# Altium project PIFRobot.PrjPCB
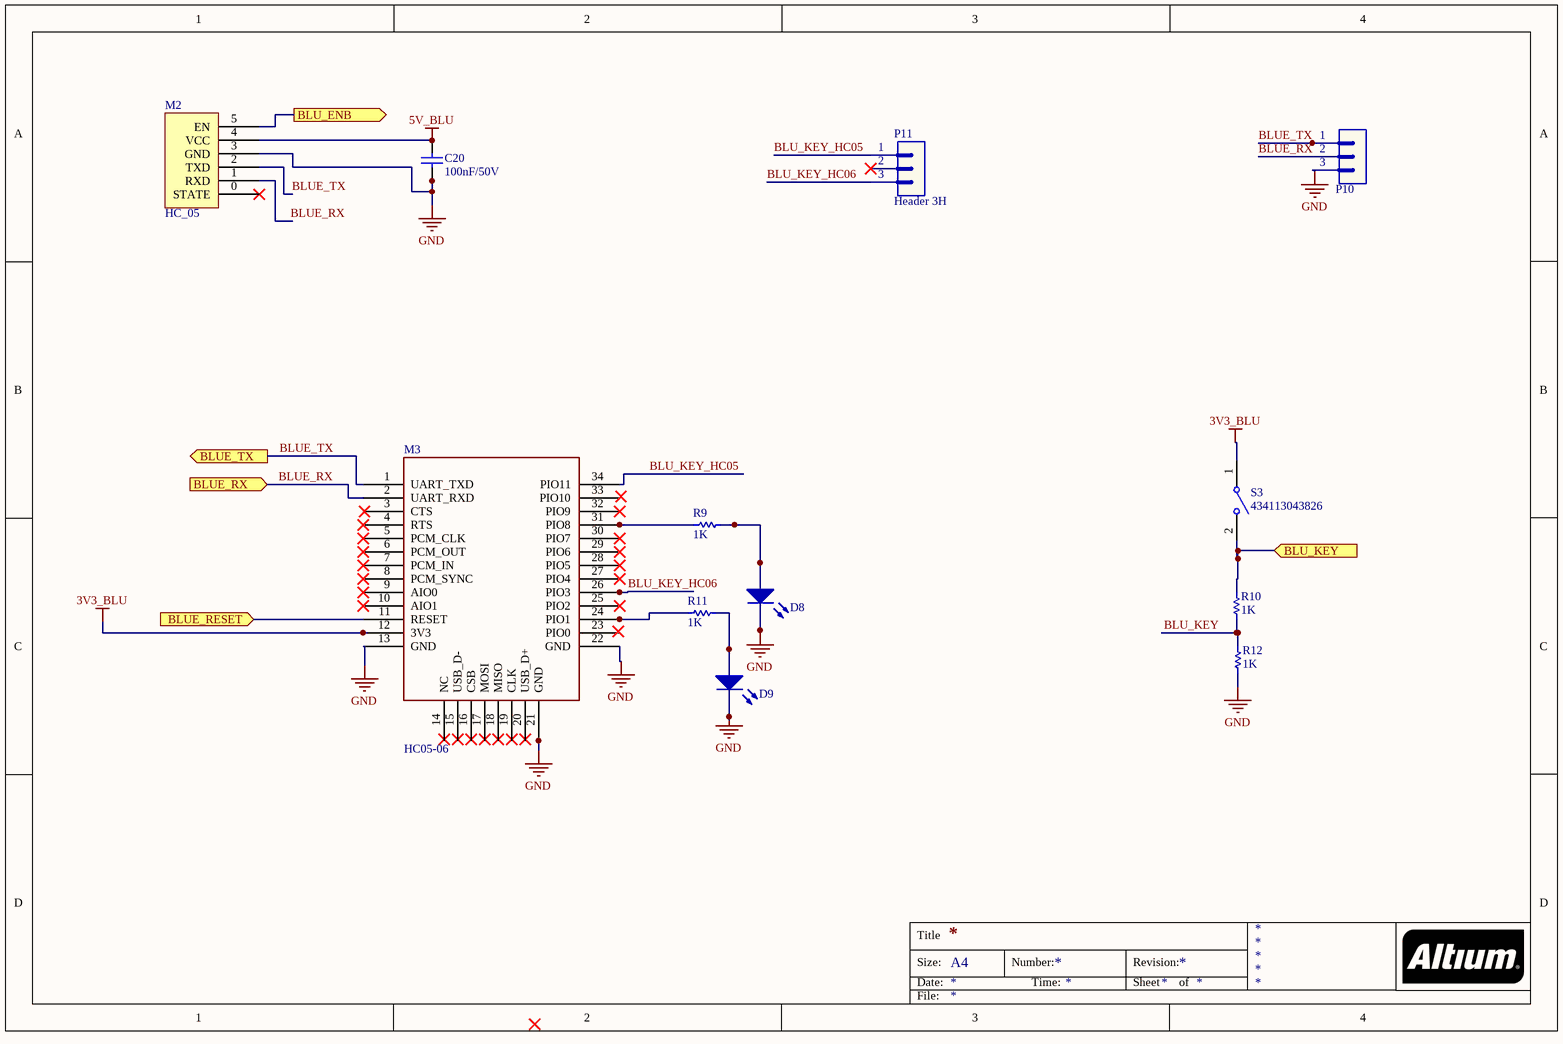
[diagram p0: Bluetooth.schdoc]
6 sheets, 118 parts. Net scope: flat (ports and power ports of the same name join across sheets).
Board file: PCB1.PcbDoc
Sheets:
  Bluetooth.schdoc
  DWM.SchDoc
  MCU.schdoc
  Motor.schdoc
  Power.SchDoc
  RF.schdoc

## Sheet Bluetooth.schdoc
size A4

### Parts
C20  value 100nF/50V  [CAP-SM-0805]  (hidden comment: Cap-100nF-50V-0805)
D8  LED  [LED_0805_Blue]  (value not drawn)
D9  LED  [LED_0805_Blue]  (value not drawn)
M2  HC_05  [PCBComponent_1]
M3  HC05-06
P10  Header 3  [JP3]  (value not drawn)
P11  Header 3H  [JP3H]
R9  value 1K  [RES-SM-0805]  (hidden comment: Resistor 1/4W)
R10  value 1K  [RES-SM-1206]  (hidden comment: Resistor 1/4W)
R11  value 1K  [RES-SM-0805]  (hidden comment: Resistor 1/4W)
R12  value 1K  [RES-SM-0805]  (hidden comment: Resistor 1/4W)
S3  434113043826  [434113043826]

### Ports
BLU_ENB (out), BLU_KEY (in), BLUE_RESET (in), BLUE_RX (in), BLUE_TX (out)

### Nets
3V3_BLU: M3.12(3V3) S3.1
5V_BLU: C20.2 M2.4(VCC)  [project net 5V]
GND: C20.1 D8.2(K) D9.2(K) M2.3(GND) M3.13(GND) M3.21(GND) M3.22(GND) P10.3 R12.1
BLU_KEY: R10.1 R12.2
BLU_KEY_HC05: M3.34(PIO11) P11.1
BLU_KEY_HC06: M3.26(PIO3) P11.3
BLUE_RX: M2.1(RXD) M3.2(UART_RXD) P10.2 ; port BLUE_RX
BLUE_TX: M2.2(TXD) M3.1(UART_TXD) P10.1 ; port BLUE_TX
NetD8_1: D8.1(A) R9.1
NetD9_1: D9.1(A) R11.1
NetM2_5: M2.5(EN) ; port BLU_ENB
NetM3_11: M3.11(RESET) ; port BLUE_RESET
NetM3_24: M3.24(PIO1) R11.2
NetM3_31: M3.31(PIO8) R9.2
NetR10_2: R10.2 S3.2 ; port BLU_KEY

Not connected (* = marked no-connect by the designer): M2 0(STATE)*; M3 3(CTS) 4(RTS)* 5(PCM_CLK)* 6(PCM_OUT)* 7(PCM_IN)* 8(PCM_SYNC)* 9(AIO0)* 10(AIO1)* 14(NC) 15(USB_D-) 16(CSB) 17(MOSI) 18(MISO) 19(CLK) 20(USB_D+) 23(PIO0) 25(PIO2)* 27(PIO4)* 28(PIO5)* 29(PIO6)* 30(PIO7)* 32(PIO9)* 33(PIO10); P11 2*

### Notes on the sheet
- Title
- Size:
- Date:
- A4
- Number:
- Time:
- Revision:
- Sheet
- of
- File:

### Library data of the parts
C20 = Cap-100nF-50V-0805: CAP CER 0.1UF 50V Y5V 0805; Manufacturer: Samsung Electro-Mechanics; Manufacturer Part Number: CL21F104ZBCNNNC; Local Supplier: thegioiic; Local Supplier Link: https://thegioiic.com/products/tu-100nf-0-1uf-50v-0805; Supplier 1: Digikey; Supplier 1 Part Number: 1276-1007-1-ND; Supplier 1 Link: https://www.digikey.com/product-detail/en/samsung-electro-mechanics/CL21F104ZBCNNNC/1276-1007-1-ND/3889093
P10 = Header 3: Header, 3-Pin; LatestRevisionDate: 17-Jul-2002; LatestRevisionNote: Re-released for DXP Platform.; Publisher: Altium Limited
P11 = Header 3H: Header, 3-Pin, Right Angle; LatestRevisionDate: 17-Jul-2002; LatestRevisionNote: Re-released for DXP Platform.; Publisher: Altium Limited
R9-R12 = RES
S3 = 434113043826: WS-TASV J-Bend SMT Tact Switch 6x3.5mm, height 4.3mm, 260gf; Rated Voltage: 12VDC; Rated Current: 50mA; Washable: No; ComponentLink1Description: Manufacturer; ComponentLink1URL: http://www.we-online.de; ComponentLink2Description: Datasheet; ComponentLink2URL: https://katalog.we-online.com/em/datasheet/434113043826.pdf; Operating Temperature: -40 to +85degC; Part Number: 434113043826; Published Date: September 2019; Contact Material: Stainless Steel; Height: 4.3mm; Mounting Technology: SMT; Contact Plating: Silver; Operation Force: 260gf; Packaging: Tape and Reel; Terminal Material: Copper Alloy; Publisher: Wurth Elektronik; Terminal Plating: Silver

## Sheet DWM.SchDoc
size A
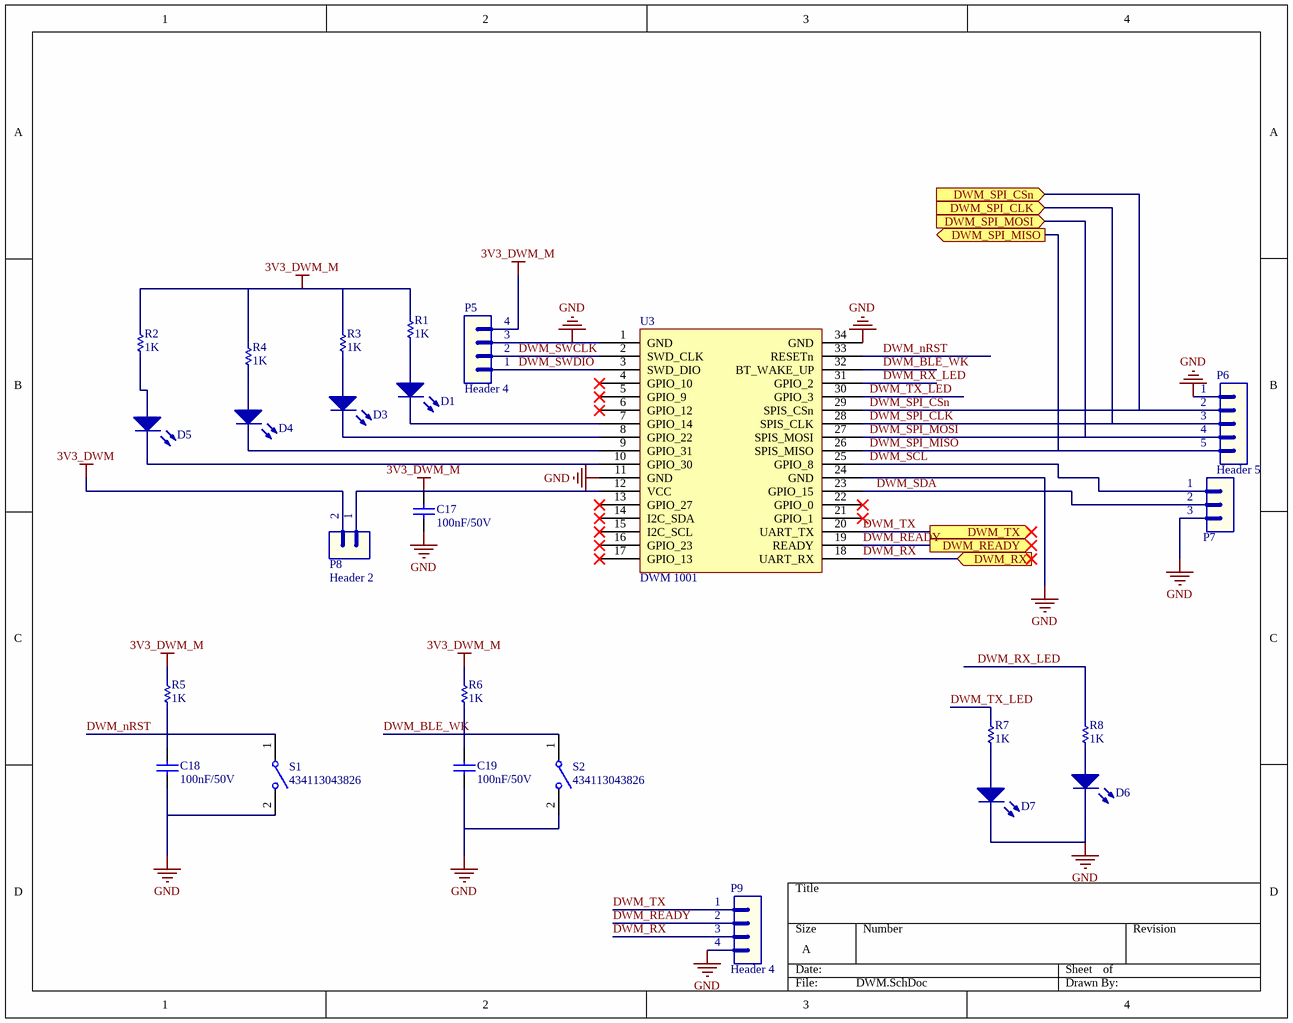
[diagram p1: DWM.SchDoc]

### Parts
C17  value 100nF/50V  [CAP-SM-0805]  (hidden comment: Cap-100nF-50V-0805)
C18  value 100nF/50V  [CAP-SM-0805]  (hidden comment: Cap-100nF-50V-0805)
C19  value 100nF/50V  [CAP-SM-0805]  (hidden comment: Cap-100nF-50V-0805)
D1  LED  [LED_0805_Blue]  (value not drawn)
D3  LED  [LED_0805_Blue]  (value not drawn)
D4  LED  [LED_0805_Blue]  (value not drawn)
D5  LED  [LED_0805_Blue]  (value not drawn)
D6  LED  [LED_0805_Blue]  (value not drawn)
D7  LED  [LED_0805_Blue]  (value not drawn)
P5  Header 4  [JP4]
P6  Header 5  [JP5]
P7  Header 3  [JP3]  (value not drawn)
P8  Header 2  [JP2]
P9  Header 4  [JP4]
R1  value 1K  [RES-SM-0805]  (hidden comment: Resistor 1/4W)
R2  value 1K  [RES-SM-0805]  (hidden comment: Resistor 1/4W)
R3  value 1K  [RES-SM-0805]  (hidden comment: Resistor 1/4W)
R4  value 1K  [RES-SM-0805]  (hidden comment: Resistor 1/4W)
R5  value 1K  [RES-SM-0805]  (hidden comment: Resistor 1/4W)
R6  value 1K  [RES-SM-0805]  (hidden comment: Resistor 1/4W)
R7  value 1K  [RES-SM-0805]  (hidden comment: Resistor 1/4W)
R8  value 1K  [RES-SM-0805]  (hidden comment: Resistor 1/4W)
S1  434113043826  [434113043826]
S2  434113043826  [434113043826]
U3  DWM 1001  [PCBComponent_1]

### Ports
DWM_READY (out), DWM_RX (in), DWM_SPI_CLK (in), DWM_SPI_CSn (in), DWM_SPI_MISO (out), DWM_SPI_MOSI (in), DWM_TX (out)

### Nets
3V3_DWM: P8.2
3V3_DWM_M: C17.2 P5.4 P8.1 R1.2 R2.2 R3.2 R4.2 R5.2 R6.2 U3.12(VCC)
GND: C17.1 C18.1 C19.1 D6.2(K) D7.2(K) P5.3 P6.1 P7.3 P9.4 S1.2 S2.2 U3.1(GND) U3.11(GND) U3.24(GND) U3.34(GND)
DWM_BLE_WK: C19.2 R6.1 S2.1 U3.32(BT_WAKE_UP)
DWM_nRST: C18.2 R5.1 S1.1 U3.33(RESETn)
DWM_READY: P9.2 U3.19(READY) ; port DWM_READY
DWM_RX: P9.3 U3.18(UART_RX) ; port DWM_RX
DWM_RX_LED: R8.2 U3.31(GPIO_2)
DWM_SCL: P7.1 U3.25(GPIO_8)
DWM_SDA: P7.2 U3.23(GPIO_15)
DWM_SPI_CLK: P6.3 U3.28(SPIS_CLK) ; port DWM_SPI_CLK
DWM_SPI_CSn: P6.2 U3.29(SPIS_CSn) ; port DWM_SPI_CSn
DWM_SPI_MISO: P6.5 U3.26(SPIS_MISO) ; port DWM_SPI_MISO
DWM_SPI_MOSI: P6.4 U3.27(SPIS_MOSI) ; port DWM_SPI_MOSI
DWM_SWCLK: P5.2 U3.2(SWD_CLK)
DWM_SWDIO: P5.1 U3.3(SWD_DIO)
DWM_TX: P9.1 U3.20(UART_TX) ; port DWM_TX
DWM_TX_LED: R7.2 U3.30(GPIO_3)
NetD1_1: D1.1(A) R1.1
NetD1_2: D1.2(K) U3.7(GPIO_14)
NetD3_1: D3.1(A) R3.1
NetD3_2: D3.2(K) U3.8(GPIO_22)
NetD4_1: D4.1(A) R4.1
NetD4_2: D4.2(K) U3.9(GPIO_31)
NetD5_1: D5.1(A) R2.1
NetD5_2: D5.2(K) U3.10(GPIO_30)
NetD6_1: D6.1(A) R8.1
NetD7_1: D7.1(A) R7.1

Not connected (* = marked no-connect by the designer): U3 4(GPIO_10)* 5(GPIO_9)* 6(GPIO_12)* 13(GPIO_27)* 14(I2C_SDA)* 15(I2C_SCL)* 16(GPIO_23)* 17(GPIO_13)* 21(GPIO_1)* 22(GPIO_0)*

### Library data of the parts
C17-C19 = Cap-100nF-50V-0805: as C20 on sheet Bluetooth; Local Supplier: thegioiic; Local Supplier Link: https://thegioiic.com/products/tu-100nf-0-1uf-50v-0805; Supplier 1: Digikey; Supplier 1 Part Number: 1276-1007-1-ND; Supplier 1 Link: https://www.digikey.com/product-detail/en/samsung-electro-mechanics/CL21F104ZBCNNNC/1276-1007-1-ND/3889093
P5 P9 = Header 4: Header, 4-Pin; LatestRevisionDate: 17-Jul-2002; LatestRevisionNote: Re-released for DXP Platform.; Publisher: Altium Limited
P6 = Header 5: Header, 5-Pin; LatestRevisionDate: 17-Jul-2002; LatestRevisionNote: Re-released for DXP Platform.; Publisher: Altium Limited
P7 = Header 3: Header, 3-Pin; LatestRevisionDate: 17-Jul-2002; LatestRevisionNote: Re-released for DXP Platform.; Publisher: Altium Limited
P8 = Header 2: Header, 2-Pin; LatestRevisionDate: 17-Jul-2002; LatestRevisionNote: Re-released for DXP Platform.; Publisher: Altium Limited
R1-R8 = RES
S1 S2 = 434113043826: as S3 on sheet Bluetooth; ComponentLink1Description: Manufacturer; ComponentLink1URL: http://www.we-online.de; ComponentLink2Description: Datasheet; ComponentLink2URL: https://katalog.we-online.com/em/datasheet/434113043826.pdf; Operating Temperature: -40 to +85degC; Part Number: 434113043826; Published Date: September 2019; Contact Material: Stainless Steel; Height: 4.3mm; Mounting Technology: SMT; Contact Plating: Silver; Operation Force: 260gf; Packaging: Tape and Reel; Terminal Material: Copper Alloy; Publisher: Wurth Elektronik; Terminal Plating: Silver

## Sheet MCU.schdoc
size A4
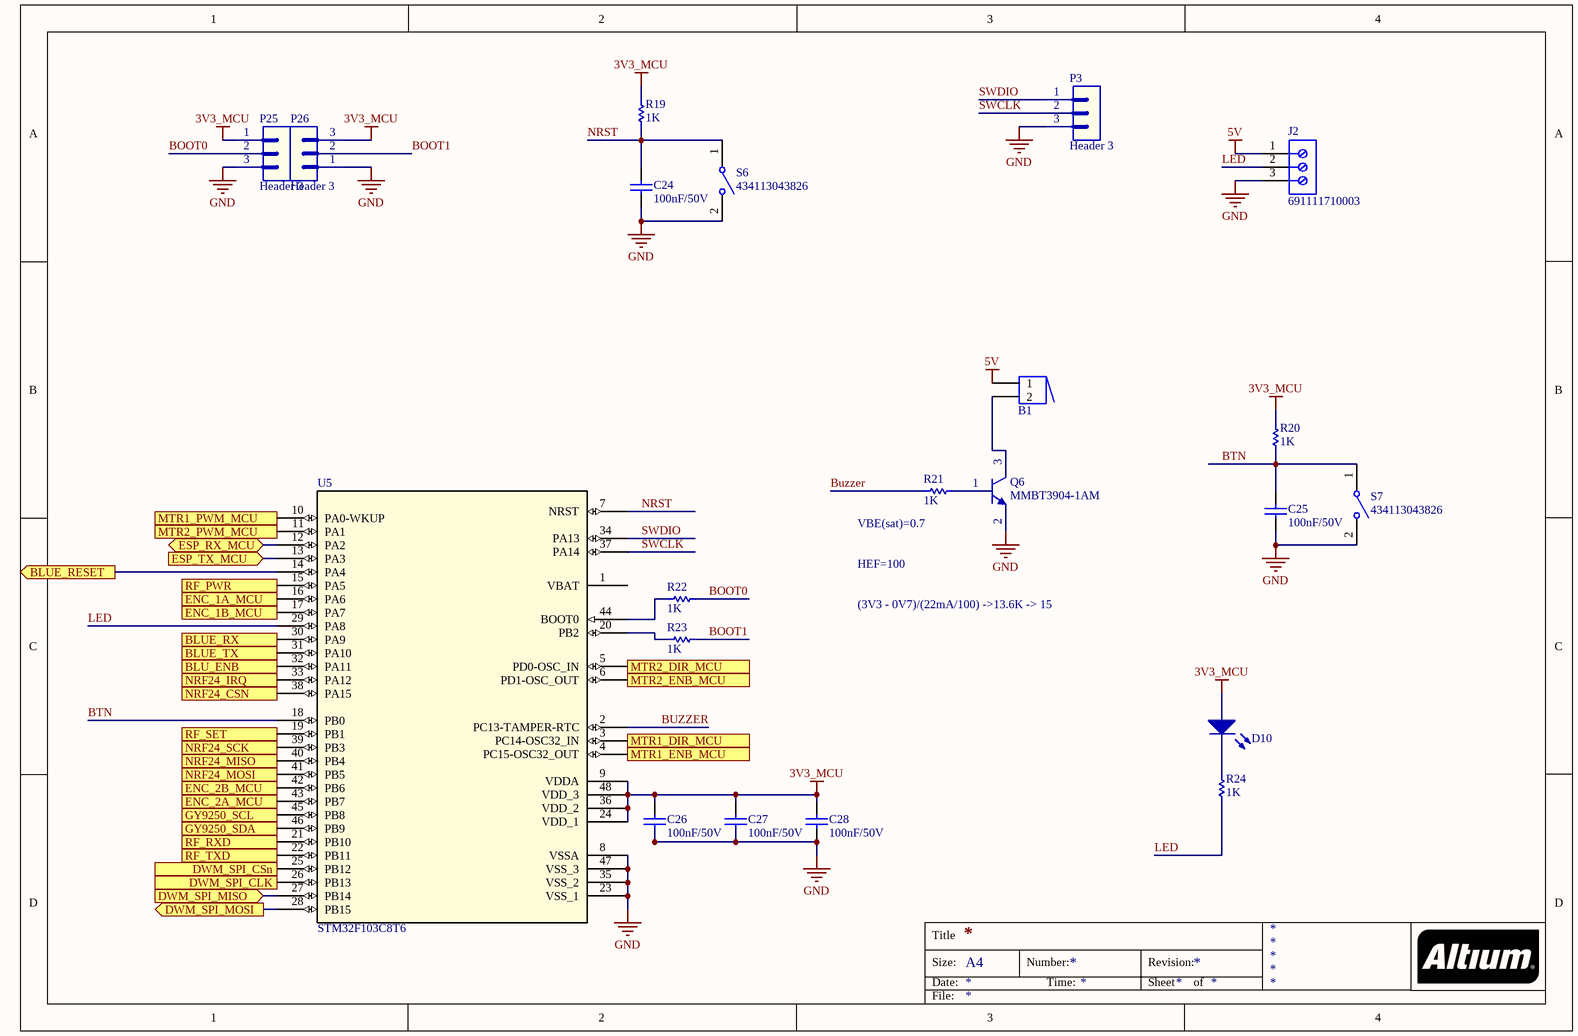
[diagram p2: MCU.schdoc]

### Parts
B1  Buzzer  [BUZZER]  (value not drawn)
C24  value 100nF/50V  [CAP-SM-0805]  (hidden comment: Cap-100nF-50V-0805)
C25  value 100nF/50V  [CAP-SM-0805]  (hidden comment: Cap-100nF-50V-0805)
C26  value 100nF/50V  [CAP-SM-0805]  (hidden comment: Cap-100nF-50V-0805)
C27  value 100nF/50V  [CAP-SM-0805]  (hidden comment: Cap-100nF-50V-0805)
C28  value 100nF/50V  [CAP-SM-0805]  (hidden comment: Cap-100nF-50V-0805)
D10  LED  [LED_0805_Blue]  (value not drawn)
J2  691111710003  [691111710003]
P3  Header 3  [JP3]
P25  Header 3  [JP3]
P26  Header 3  [JP3]
Q6  MMBT3904-1AM  [SOT23_NEX]
R19  value 1K  [RES-SM-0805]  (hidden comment: Resistor 1/4W)
R20  value 1K  [RES-SM-0805]  (hidden comment: Resistor 1/4W)
R21  value 1K  [RES-SM-0805]  (hidden comment: Resistor 1/4W)
R22  value 1K  [RES-SM-0805]  (hidden comment: Resistor 1/4W)
R23  value 1K  [RES-SM-0805]  (hidden comment: Resistor 1/4W)
R24  value 1K  [RES-SM-0805]  (hidden comment: Resistor 1/4W)
S6  434113043826  [434113043826]
S7  434113043826  [434113043826]
U5  STM32F103C8T6

### Ports
BLU_ENB (out), BLUE_RESET (out), BLUE_RX (out), BLUE_TX (in), DWM_SPI_CLK (out), DWM_SPI_CSn (out), DWM_SPI_MISO (in), DWM_SPI_MOSI (out), ENC_1A_MCU (in), ENC_1B_MCU (in), ENC_2A_MCU, ENC_2B_MCU, ESP_RX_MCU (bidir), ESP_TX_MCU (in), GY9250_SCL (out), GY9250_SDA (out), MTR1_DIR_MCU (out), MTR1_ENB_MCU (out), MTR1_PWM_MCU (out), MTR2_DIR_MCU (out), MTR2_ENB_MCU (out), MTR2_PWM_MCU (out), NRF24_CSN (out), NRF24_IRQ (in), NRF24_MISO (in), NRF24_MOSI (out), NRF24_SCK (out), RF_PWR (out), RF_RXD (out), RF_SET (out), RF_TXD (in)

### Nets
3V3_MCU: C26.2 C27.2 C28.2 D10.1(A) P25.1 P26.3 R19.2 R20.2 U5.9(VDDA) U5.24(VDD_1) U5.36(VDD_2) U5.48(VDD_3)  [project net 3V3_MC]
5V: B1.1 J2.1
GND: C24.1 C25.1 C26.1 C27.1 C28.1 J2.3 P3.3 P25.3 P26.1 Q6.2(E) S6.2 S7.2 U5.8(VSSA) U5.23(VSS_1) U5.35(VSS_2) U5.47(VSS_3)
BLUE_RX: U5.30(PA9) ; port BLUE_RX
BLUE_TX: U5.31(PA10) ; port BLUE_TX
BOOT0: P25.2 R22.1
BOOT1: P26.2 R23.1
BTN: C25.2 R20.1 S7.1 U5.18(PB0)
Buzzer: R21.2 U5.2(PC13-TAMPER-RTC)
DWM_SPI_CLK: U5.26(PB13) ; port DWM_SPI_CLK
DWM_SPI_CSn: U5.25(PB12) ; port DWM_SPI_CSn
DWM_SPI_MISO: U5.27(PB14) ; port DWM_SPI_MISO
DWM_SPI_MOSI: U5.28(PB15) ; port DWM_SPI_MOSI
LED: J2.2 R24.1 U5.29(PA8)
NRST: C24.2 R19.1 S6.1 U5.7(NRST)
RF_RXD: U5.21(PB10) ; port RF_RXD
RF_SET: U5.19(PB1) ; port RF_SET
RF_TXD: U5.22(PB11) ; port RF_TXD
SWCLK: P3.2 U5.37(PA14)
SWDIO: P3.1 U5.34(PA13)
NetB1_2: B1.2 Q6.3(C)
NetD10_2: D10.2(K) R24.2
NetM2_5: U5.32(PA11) ; port BLU_ENB
NetM3_11: U5.14(PA4) ; port BLUE_RESET
NetM6_4: U5.38(PA15) ; port NRF24_CSN
NetM6_5: U5.39(PB3) ; port NRF24_SCK
NetM6_6: U5.41(PB5) ; port NRF24_MOSI
NetM6_7: U5.40(PB4) ; port NRF24_MISO
NetM6_8: U5.33(PA12) ; port NRF24_IRQ
NetQ6_1: Q6.1(B) R21.1
NetR22_2: R22.2 U5.44(BOOT0)
NetR23_2: R23.2 U5.20(PB2)
NetR26_1: U5.15(PA5) ; port RF_PWR
NetU4_2: U5.10(PA0-WKUP) ; port MTR1_PWM_MCU
NetU4_3: U5.3(PC14-OSC32_IN) ; port MTR1_DIR_MCU
NetU4_4: U5.11(PA1) ; port MTR2_PWM_MCU
NetU4_5: U5.5(PD0-OSC_IN) ; port MTR2_DIR_MCU
NetU4_6: U5.4(PC15-OSC32_OUT) ; port MTR1_ENB_MCU
NetU4_7: U5.6(PD1-OSC_OUT) ; port MTR2_ENB_MCU
NetU5_12: U5.12(PA2) ; port ESP_RX_MCU
NetU5_13: U5.13(PA3) ; port ESP_TX_MCU
NetU5_16: U5.16(PA6) ; port ENC_1A_MCU
NetU5_17: U5.17(PA7) ; port ENC_1B_MCU
NetU5_42: U5.42(PB6) ; port ENC_2B_MCU
NetU5_43: U5.43(PB7) ; port ENC_2A_MCU
NetU5_45: U5.45(PB8) ; port GY9250_SCL
NetU5_46: U5.46(PB9) ; port GY9250_SDA

Not connected (* = marked no-connect by the designer): U5 1(VBAT)

### Notes on the sheet
- (near R21) VBE(sat)=0.7
- HEF=100
- (3V3 - 0V7)/(22mA/100) ->13.6K -> 15
- Title
- Size:
- Date:
- A4
- Number:
- Time:
- Revision:
- Sheet
- of
- File:

### Library data of the parts
C24-C28 = Cap-100nF-50V-0805: as C20 on sheet Bluetooth; Local Supplier: thegioiic; Local Supplier Link: https://thegioiic.com/products/tu-100nf-0-1uf-50v-0805; Supplier 1: Digikey; Supplier 1 Part Number: 1276-1007-1-ND; Supplier 1 Link: https://www.digikey.com/product-detail/en/samsung-electro-mechanics/CL21F104ZBCNNNC/1276-1007-1-ND/3889093
J2 = 691111710003: WR-TBL Serie 111 Horizontal Entry Modular, Pressure Clamp, pitch 5mm, 3p; Compliance: Lead free / RoHS; Modularity: Yes; PCB/Cable/Panel: PCB; Pin Number: 3; Rated Current [UL]: 15A; Working Voltage [UL]: 250VAC; ComponentLink1Description: Manufacturer; ComponentLink1URL: http://www.we-online.de; ComponentLink2URL: https://katalog.we-online.de/em/datasheet/691111710003.pdf; ComponentLink2Description: Datasheet; Mounting Technology: THT; Part Number: 691111710003; Packaging: Box; Operating Temperature: -40 to +105degC; Pitch: 5mm; Published Date: October 2019; Type: Horizontal; Publisher: Wurth Elektronik; Application: Pressure Clamp
P3 P25 P26 = Header 3: Header, 3-Pin; LatestRevisionDate: 17-Jul-2002; LatestRevisionNote: Re-released for DXP Platform.; Publisher: Altium Limited
R19-R24 = RES
S6 S7 = 434113043826: as S3 on sheet Bluetooth; ComponentLink1Description: Manufacturer; ComponentLink1URL: http://www.we-online.de; ComponentLink2Description: Datasheet; ComponentLink2URL: https://katalog.we-online.com/em/datasheet/434113043826.pdf; Operating Temperature: -40 to +85degC; Part Number: 434113043826; Published Date: September 2019; Contact Material: Stainless Steel; Height: 4.3mm; Mounting Technology: SMT; Contact Plating: Silver; Operation Force: 260gf; Packaging: Tape and Reel; Terminal Material: Copper Alloy; Publisher: Wurth Elektronik; Terminal Plating: Silver
U5 = STM32F103C8T6: No Description Available; SourceLibrary: StMicro_2011-06-07; Built_By: EMA_UL_Team; Vendor: STMicroelectronics; Manufacturer_Part_Number: STM32F103C8T6; Copyright: Copyright (C) 2018 Accelerated Designs. All rights reserved; RefDes: RefDes; Type: DEV

## Sheet Motor.schdoc
size A4
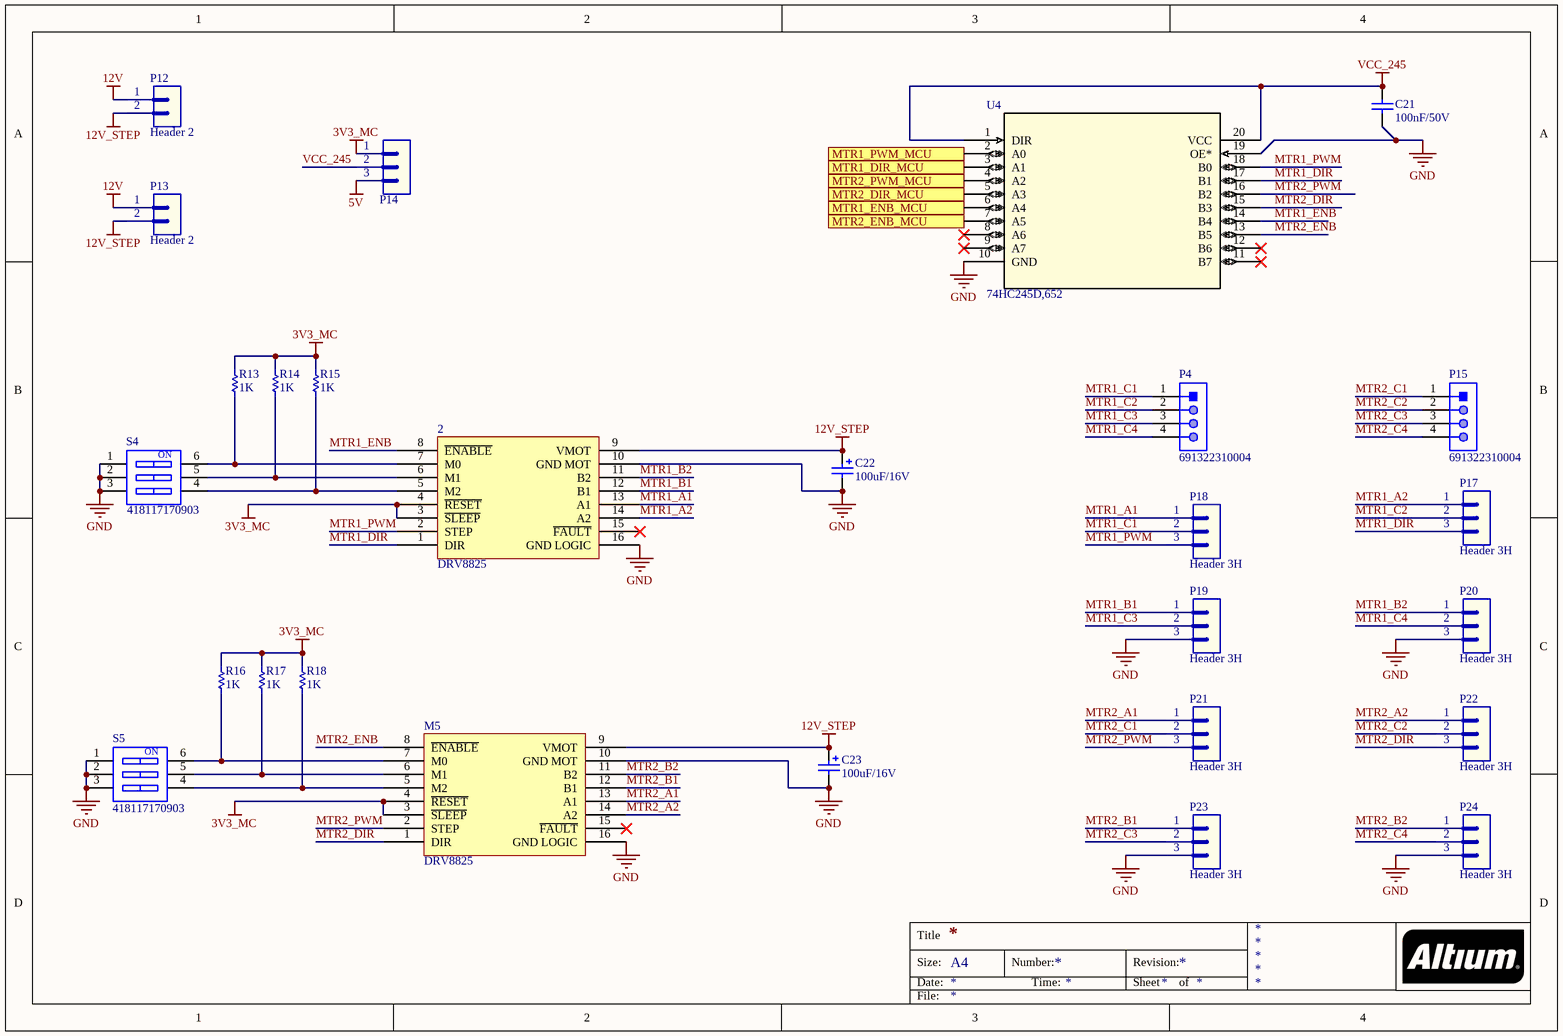
[diagram p3: Motor.schdoc]

### Parts
2  DRV8825  [PCBComponent_1]
C21  value 100nF/50V  [CAP-SM-0805]  (hidden comment: Cap-100nF-50V-0805)
C22  value 100uF/16V  [CAP-SM-AL-SIZE-D-D6L6]  (hidden comment: Cap-Al-100uF-16V-D6L5)
C23  value 100uF/16V  [CAP-SM-AL-SIZE-D-D6L6]  (hidden comment: Cap-Al-100uF-16V-D6L5)
M5  DRV8825  [PCBComponent_1]
P4  691322310004  [691322310004]
P12  Header 2  [JP2]
P13  Header 2  [JP2]
P14  Header 3  [JP3]  (value not drawn)
P15  691322310004  [691322310004]
P17  Header 3H  [JP3H]
P18  Header 3H  [JP3H]
P19  Header 3H  [JP3H]
P20  Header 3H  [JP3H]
P21  Header 3H  [JP3H]
P22  Header 3H  [JP3H]
P23  Header 3H  [JP3H]
P24  Header 3H  [JP3H]
R13  value 1K  [RES-SM-0805]  (hidden comment: Resistor 1/4W)
R14  value 1K  [RES-SM-0805]  (hidden comment: Resistor 1/4W)
R15  value 1K  [RES-SM-0805]  (hidden comment: Resistor 1/4W)
R16  value 1K  [RES-SM-0805]  (hidden comment: Resistor 1/4W)
R17  value 1K  [RES-SM-0805]  (hidden comment: Resistor 1/4W)
R18  value 1K  [RES-SM-0805]  (hidden comment: Resistor 1/4W)
S4  418117170903  [PCBComponent_1]
S5  418117170903  [PCBComponent_1]
U4  74HC245D,652  [SOT163-1_NEX]

### Ports
MTR1_DIR_MCU (in), MTR1_ENB_MCU (in), MTR1_PWM_MCU (in), MTR2_DIR_MCU (in), MTR2_ENB_MCU (in), MTR2_PWM_MCU (in)

### Nets
3V3_MC: 2.3(~{SLEEP}) 2.4(~{RESET}) M5.3(~{SLEEP}) M5.4(~{RESET}) P14.1 R13.2 R14.2 R15.2 R16.2 R17.2 R18.2
5V: P14.3
12V: P12.1 P13.1
12V_STEP: 2.9(VMOT) C22.1 C23.1 M5.9(VMOT) P12.2 P13.2
GND: 2.10(GND_MOT) 2.16(GND_LOGIC) C21.1 C22.2 C23.2 M5.10(GND_MOT) M5.16(GND_LOGIC) P19.3 P20.3 P23.3 P24.3 S4.1 S4.2 S4.3 S5.1 S5.2 S5.3 U4.10(GND) U4.19(OE*)
VCC_245: C21.2 P14.2 U4.1(DIR) U4.20(VCC)
MTR1_A1: 2.13(A1) P18.1
MTR1_A2: 2.14(A2) P17.1
MTR1_B1: 2.12(B1) P19.1
MTR1_B2: 2.11(B2) P20.1
MTR1_C1: P4.1 P18.2
MTR1_C2: P4.2 P17.2
MTR1_C3: P4.3 P19.2
MTR1_C4: P4.4 P20.2
MTR1_DIR: 2.1(DIR) P17.3 U4.17(B1)
MTR1_ENB: 2.8(~{ENABLE}) U4.14(B4)
MTR1_PWM: 2.2(STEP) P18.3 U4.18(B0)
MTR2_A1: M5.13(A1) P21.1
MTR2_A2: M5.14(A2) P22.1
MTR2_B1: M5.12(B1) P23.1
MTR2_B2: M5.11(B2) P24.1
MTR2_C1: P15.1 P21.2
MTR2_C2: P15.2 P22.2
MTR2_C3: P15.3 P23.2
MTR2_C4: P15.4 P24.2
MTR2_DIR: M5.1(DIR) P22.3 U4.15(B3)
MTR2_ENB: M5.8(~{ENABLE}) U4.13(B5)
MTR2_PWM: M5.2(STEP) P21.3 U4.16(B2)
Net2_5: 2.5(M2) R15.1 S4.4
Net2_6: 2.6(M1) R14.1 S4.5
Net2_7: 2.7(M0) R13.1 S4.6
NetM5_5: M5.5(M2) R18.1 S5.4
NetM5_6: M5.6(M1) R17.1 S5.5
NetM5_7: M5.7(M0) R16.1 S5.6
NetU4_2: U4.2(A0) ; port MTR1_PWM_MCU
NetU4_3: U4.3(A1) ; port MTR1_DIR_MCU
NetU4_4: U4.4(A2) ; port MTR2_PWM_MCU
NetU4_5: U4.5(A3) ; port MTR2_DIR_MCU
NetU4_6: U4.6(A4) ; port MTR1_ENB_MCU
NetU4_7: U4.7(A5) ; port MTR2_ENB_MCU

Not connected (* = marked no-connect by the designer): 2 15(~{FAULT})*; M5 15(~{FAULT})*; U4 8(A6)* 9(A7)* 11(B7)* 12(B6)*

### Notes on the sheet
- Title
- Size:
- Date:
- A4
- Number:
- Time:
- Revision:
- Sheet
- of
- File:
- (in symbol 418117170903) ON

### Library data of the parts
C21 = Cap-100nF-50V-0805: as C20 on sheet Bluetooth; Local Supplier: thegioiic; Local Supplier Link: https://thegioiic.com/products/tu-100nf-0-1uf-50v-0805; Supplier 1: Digikey; Supplier 1 Part Number: 1276-1007-1-ND; Supplier 1 Link: https://www.digikey.com/product-detail/en/samsung-electro-mechanics/CL21F104ZBCNNNC/1276-1007-1-ND/3889093
C22 C23 = Cap-Al-100uF-16V-D6L5: CAP ALUM 100UF 20% 16V SMD; Manufacturer: Nichicon; Manufacturer Part Number: UWX1C101MCL1GB; Local Supplier: thegioiic; Local Supplier Link: https://thegioiic.com/products/tu-nhom-smd-100uf-16v-d6-3l5-4; Supplier 1: Digikey; Supplier 1 Part Number: 493-2105-1-ND; Supplier 1 Link: https://www.digikey.com/product-detail/en/nichicon/UWX1C101MCL1GB/493-2105-1-ND/590080
P4 P15 = 691322310004: WR-TBL Serie 322 Horizontal PCB Header, Pluggable, pitch 3.81mm, 4p; Compliance: RoHS; Modularity: No; Pin Number: 4; Rated Current [UL]: 10A; Working Voltage [UL]: 300VAC; ComponentLink1Description: Manufacturer; ComponentLink1URL: http://www.we-online.de; ComponentLink2URL: https://katalog.we-online.de/em/datasheet/691322310004.pdf; ComponentLink2Description: Datasheet; Mounting Technology: THT; Part Number: 691322310004; Packaging: Box; Operating Temperature: -40 to +105degC; PCB/Cable/Panel: PCB; Pitch: 3.81mm; Published Date: October 2019; Type: Horizontal; Publisher: Wurth Elektronik; Application: Pluggable
P12 P13 = Header 2: Header, 2-Pin; LatestRevisionDate: 17-Jul-2002; LatestRevisionNote: Re-released for DXP Platform.; Publisher: Altium Limited
P14 = Header 3: Header, 3-Pin; LatestRevisionDate: 17-Jul-2002; LatestRevisionNote: Re-released for DXP Platform.; Publisher: Altium Limited
P17-P24 = Header 3H: Header, 3-Pin, Right Angle; LatestRevisionDate: 17-Jul-2002; LatestRevisionNote: Re-released for DXP Platform.; Publisher: Altium Limited
R13-R18 = RES
S4 S5 = 418117170903: WS-DITV Compact THT Dip Switch, Flat Actuator, pitch 2.54mm, 3p; Operation Force: 800g; Pole Number: 3; Actuator Type: Flat Type; Circuit: SPST-NO; Rated Current Switching: 25mA; Rated Current Non-Switching: 100mA; Rated Voltage Non-Switching: 50VDC; Rated Voltage Switching: 24VDC; ComponentLink1Description: Manufacturer; ComponentLink1URL: http://www.we-online.de; ComponentLink2Description: Datasheet; ComponentLink2URL: https://katalog.we-online.com/em/datasheet/418117170903.pdf; Pitch: 2.54mm; Contact Material: Copper Alloy; Mounting Technology: THT; Operating Temperature: -40 to +85degC; Contact Plating: Gold; Packaging: Tube; Part Number: 418117170903; Publisher: Wurth Elektronik; Published Date: September 2019
U4 = 74HC245D,652: No Description Available; Vendor: Nexperia; SourceLibrary: Nexperia_2018-05-2018; Manufacturer_Part_Number: 74HC245D,652; Copyright: Copyright (C) 2016 Accelerated Designs. All rights reserved; RefDes: RefDes; Type: DEV

## Sheet Power.SchDoc
size A
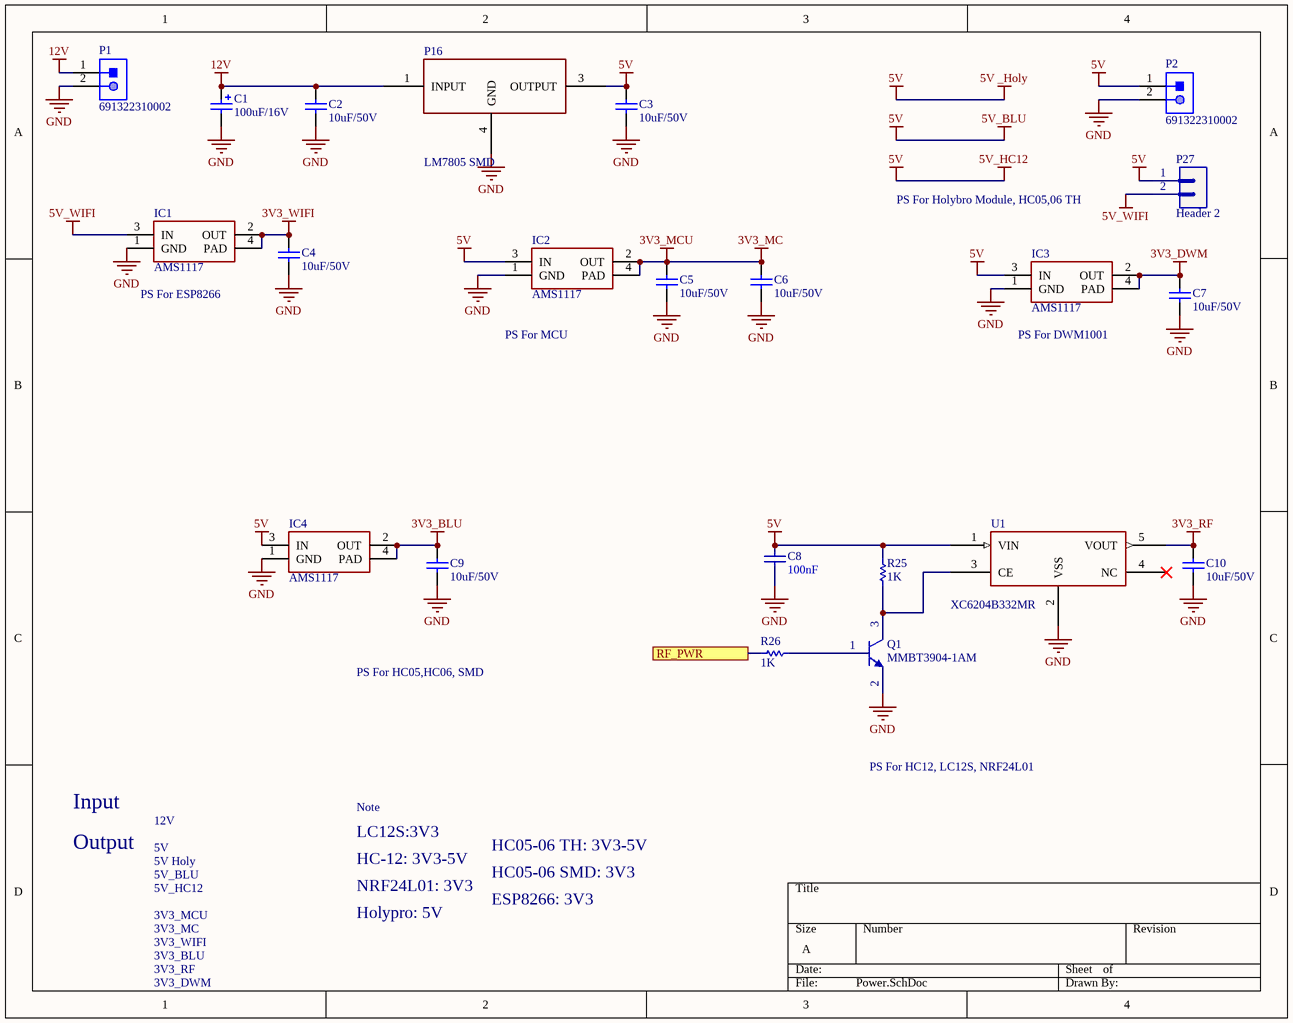
[diagram p4: Power.SchDoc]

### Parts
C1  value 100uF/16V  [CAP_SM_TAN]  (hidden comment: TAJB107M006RNJ)
C2  value 10uF/50V  [CAP-SM-0805]  (hidden comment: Cap-10uF-50V-0805)
C3  value 10uF/50V  [CAP-SM-0805]  (hidden comment: Cap-10uF-50V-0805)
C4  value 10uF/50V  [CAP-SM-0805]  (hidden comment: Cap-10uF-50V-0805)
C5  value 10uF/50V  [CAP-SM-0805]  (hidden comment: Cap-10uF-50V-0805)
C6  value 10uF/50V  [CAP-SM-0805]  (hidden comment: Cap-10uF-50V-0805)
C7  value 10uF/50V  [CAP-SM-0805]  (hidden comment: Cap-10uF-50V-0805)
C8  value 100nF  [CAP-SM-0805]  (hidden comment: Cap Non-Pol SMD)
C9  value 10uF/50V  [CAP-SM-0805]  (hidden comment: Cap-10uF-50V-0805)
C10  value 10uF/50V  [CAP-SM-0805]  (hidden comment: Cap-10uF-50V-0805)
IC1  AMS1117  [SOT223]
IC2  AMS1117  [SOT223]
IC3  AMS1117  [SOT223]
IC4  AMS1117  [SOT223]
P1  691322310002  [691322310002]
P2  691322310002  [691322310002]
P16  LM7805 SMD  [D2PAK_STM]
P27  Header 2  [JP2]
Q1  MMBT3904-1AM  [SOT23_NEX]
R25  value 1K  [RES-SM-0805]  (hidden comment: Resistor 1/4W)
R26  value 1K  [RES-SM-0805]  (hidden comment: Resistor 1/4W)
U1  XC6204B332MR  [XC6204/05_SOT-00]

### Ports
RF_PWR (in)

### Nets
3V3_BLU: C9.2 IC4.2(OUT) IC4.4(PAD)
3V3_DWM: C7.2 IC3.2(OUT) IC3.4(PAD)
3V3_MC: C5.2 C6.2 IC2.2(OUT) IC2.4(PAD)  [also labelled 3V3_MCU]
3V3_RF: C10.2 U1.5(VOUT)
3V3_WIFI: C4.2 IC1.2(OUT) IC1.4(PAD)
5V: C3.2 C8.2 IC2.3(IN) IC3.3(IN) IC4.3(IN) P2.1 P16.3(OUTPUT) P27.1 R25.2 U1.1(VIN)  [also labelled 5V _Holy, 5V_BLU, 5V_HC12]
5V_WIFI: IC1.3(IN) P27.2
12V: C1.1 C2.2 P1.1 P16.1(INPUT)
GND: C1.2 C2.1 C3.1 C4.1 C5.1 C6.1 C7.1 C8.1 C9.1 C10.1 IC1.1(GND) IC2.1(GND) IC3.1(GND) IC4.1(GND) P1.2 P2.2 P16.4(GND) Q1.2(E) U1.2(VSS)
NetQ1_1: Q1.1(B) R26.2
NetQ1_3: Q1.3(C) R25.1 U1.3(CE)
NetR26_1: R26.1 ; port RF_PWR

Not connected (* = marked no-connect by the designer): U1 4(NC)*

### Notes on the sheet
- PS For Holybro Module, HC05,06 TH
- (near IC1) PS For ESP8266
- PS For MCU
- (near IC3) PS For DWM1001
- PS For HC05,HC06, SMD
- PS For HC12, LC12S, NRF24L01
- Input
- 12V
- Note
- LC12S:3V3
- Output
- 5V
- 5V Holy
- 5V_BLU
- 5V_HC12
- HC-12: 3V3-5V
- NRF24L01: 3V3
- HC05-06 TH: 3V3-5V
- HC05-06 SMD: 3V3
- ESP8266: 3V3
- 3V3_MC
- 3V3_WIFI
- 3V3_BLU
- 3V3_RF
- 3V3_MCU
- Holypro: 5V
- 3V3_DWM

### Library data of the parts
C1 = Cap-Tan-100uF-16V: Manufacturer: Nichicon; Manufacturer Part Number: UWX1C101MCL1GB; Local Supplier: icdayroi; Local Supplier Link: https://icdayroi.com/tu-tantalum-100uf-16v-smd6032; Supplier 1: Digikey; Supplier 1 Part Number: 493-2105-1-ND; Supplier 1 Link: https://www.digikey.com/product-detail/en/nichicon/UWX1C101MCL1GB/493-2105-1-ND/590080
C2-C7 C9 C10 = Cap-10uF-50V-0805: CAP CER 10UF 50V X5R 0805; Manufacturer: Yageo; Manufacturer Part Number: CC0805KKX5R9BB106; Local Supplier: thegioiic; Local Supplier Link: https://thegioiic.com/products/tu-10uf-50v-0805; Supplier 1: Digikey; Supplier 1 Link: https://www.digikey.com/product-detail/en/yageo/CC0805KKX5R9BB106/311-3499-2-ND/7164383; Supplier 1 Part Number: 311-3499-2-ND
C8 = Cap Non-Pol SMD: Capacitor
IC1-IC4 = AMS1117: Available in 1.8V, 2.5V, 2.85V, 3.3V, 5V, and  Adjustable Versions; Value: LM317
P1 P2 = 691322310002: WR-TBL Serie 322 Horizontal PCB Header, Pluggable, pitch 3.81mm, 2p; Compliance: RoHS; Modularity: No; Pin Number: 2; Rated Current [UL]: 10A; Working Voltage [UL]: 300VAC; ComponentLink1Description: Manufacturer; ComponentLink1URL: http://www.we-online.de; ComponentLink2URL: https://katalog.we-online.de/em/datasheet/691322310002.pdf; ComponentLink2Description: Datasheet; Mounting Technology: THT; Part Number: 691322310002; Packaging: Box; Operating Temperature: -40 to +105degC; PCB/Cable/Panel: PCB; Pitch: 3.81mm; Published Date: October 2019; Type: Horizontal; Publisher: Wurth Elektronik; Application: Pluggable
P27 = Header 2: Header, 2-Pin; LatestRevisionDate: 17-Jul-2002; LatestRevisionNote: Re-released for DXP Platform.; Publisher: Altium Limited
R25 R26 = RES
U1 = XC6204B332MR: Vendor: Torex Semiconductor; Built_By: EMA_UL_Team; SourceLibrary: Torex_2016-07-05_1; Manufacturer_Part_Number: XC6204B332MR; Copyright: Copyright (C) 2018 Accelerated Designs. All rights reserved; RefDes: RefDes; Type: DEV
P16 = LM7805 SMD: Local Supplier: *; Local Supplier Link: *; Local Supplier Part Number: *; Mannufacture: *; Mannufacture Part Number: *

## Sheet RF.schdoc
size A4
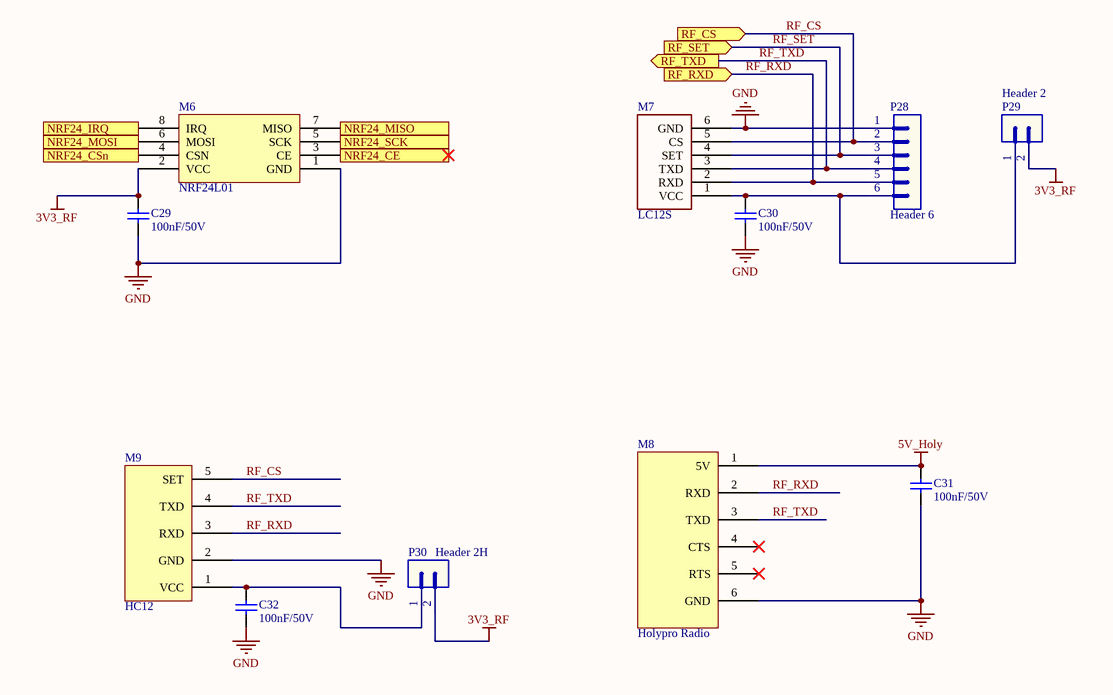
[diagram p5: RF.schdoc]

### Parts
C29  value 100nF/50V  [CAP-SM-0805]  (hidden comment: Cap-100nF-50V-0805)
C30  value 100nF/50V  [CAP-SM-0805]  (hidden comment: Cap-100nF-50V-0805)
C31  value 100nF/50V  [CAP-SM-0805]  (hidden comment: Cap-100nF-50V-0805)
C32  value 100nF/50V  [CAP-SM-0805]  (hidden comment: Cap-100nF-50V-0805)
M6  NRF24L01  [NRF24L01]
M7  LC12S  [LC12S]
M8  Holypro Radio  [PCBComponent_1]
M9  HC12  [PCBComponent_1]
P28  Header 6  [JP6]
P29  Header 2  [JP2]
P30  Header 2H  [JP2H]

### Ports
NRF24_CE (in), NRF24_CSn (in), NRF24_IRQ (out), NRF24_MISO (out), NRF24_MOSI (in), NRF24_SCK (in), RF_CS (in), RF_RXD (in), RF_SET (in), RF_TXD (out)

### Nets
3V3_RF: C29.2 M6.2(VCC) P29.2 P30.2
5V_Holy: C31.2 M8.1(5V)
GND: C29.1 C30.1 C31.1 C32.1 M6.1(GND) M7.6(GND) M8.6(GND) M9.2(GND) P28.1
RF_CS: M7.5(CS) M9.5(SET) P28.2 ; port RF_CS
RF_RXD: M7.2(RXD) M8.2(RXD) M9.3(RXD) P28.5 ; port RF_RXD
RF_SET: M7.4(SET) P28.3 ; port RF_SET
RF_TXD: M7.3(TXD) M8.3(TXD) M9.4(TXD) P28.4 ; port RF_TXD
NetC30_2: C30.2 M7.1(VCC) P28.6 P29.1
NetC32_2: C32.2 M9.1(VCC) P30.1
NetM6_3: M6.3(CE) ; port NRF24_CE
NetM6_4: M6.4(CSN) ; port NRF24_CSn
NetM6_5: M6.5(SCK) ; port NRF24_SCK
NetM6_6: M6.6(MOSI) ; port NRF24_MOSI
NetM6_7: M6.7(MISO) ; port NRF24_MISO
NetM6_8: M6.8(IRQ) ; port NRF24_IRQ

Not connected (* = marked no-connect by the designer): M8 4(CTS)* 5(RTS)*

### Notes on the sheet
- Title
- Size:
- Date:
- A4
- Number:
- Time:
- Revision:
- Sheet
- of
- File:

### Library data of the parts
C29-C32 = Cap-100nF-50V-0805: as C20 on sheet Bluetooth; Local Supplier: thegioiic; Local Supplier Link: https://thegioiic.com/products/tu-100nf-0-1uf-50v-0805; Supplier 1: Digikey; Supplier 1 Part Number: 1276-1007-1-ND; Supplier 1 Link: https://www.digikey.com/product-detail/en/samsung-electro-mechanics/CL21F104ZBCNNNC/1276-1007-1-ND/3889093
P28 = Header 6: Header, 6-Pin; LatestRevisionDate: 17-Jul-2002; LatestRevisionNote: Re-released for DXP Platform.; Publisher: Altium Limited
P29 = Header 2: Header, 2-Pin; LatestRevisionDate: 17-Jul-2002; LatestRevisionNote: Re-released for DXP Platform.; Publisher: Altium Limited
P30 = Header 2H: Header, 2-Pin, Right Angle; LatestRevisionDate: 17-Jul-2002; LatestRevisionNote: Re-released for DXP Platform.; Publisher: Altium Limited
M6 = NRF24L01: LINK: https://lastminuteengineers.com/nrf24l01-arduino-wireless-communication/
M8 = Holypro Radio: Supplier link: https://www.lazada.vn/products/ld-holybro-433mhz-915-mhz-500-mw-thu-phat-vo-tuyen-xa-bo-v3-cho-pixhawk-4-dieu-khien-chuyen-bay-i430804435-s768474304.html?spm=a2o4n.searchlist.list.4.25396b19yIS9XO&search=1
M9 = HC12: Local supplier Part number: HS000897; Local supplier: Hshop; Local supplier link: https://hshop.vn/products/mach-thu-phat-rf-uart-si4463-433mhzkhoang-coch-1km

## Nets that join several sheets
3V3_BLU: Bluetooth (M3.12 S3.1), Power (C9.2 IC4.2 IC4.4)
3V3_DWM: DWM (P8.2), Power (C7.2 IC3.2 IC3.4)
3V3_MC: MCU (12 pins), Motor (11 pins), Power (C5.2 C6.2 IC2.2 IC2.4)
3V3_RF: Power (C10.2 U1.5), RF (C29.2 M6.2 P29.2 P30.2)
5V: Bluetooth (C20.2 M2.4), MCU (B1.1 J2.1), Motor (P14.3), Power (10 pins)
12V: Motor (P12.1 P13.1), Power (C1.1 C2.2 P1.1 P16.1)
GND: Bluetooth (9 pins), DWM (15 pins), MCU (16 pins), Motor (19 pins), Power (19 pins), RF (9 pins)
BLUE_RX: Bluetooth (M2.1 M3.2 P10.2), MCU (U5.30)
BLUE_TX: Bluetooth (M2.2 M3.1 P10.1), MCU (U5.31)
DWM_SPI_CLK: DWM (P6.3 U3.28), MCU (U5.26)
DWM_SPI_CSn: DWM (P6.2 U3.29), MCU (U5.25)
DWM_SPI_MISO: DWM (P6.5 U3.26), MCU (U5.27)
DWM_SPI_MOSI: DWM (P6.4 U3.27), MCU (U5.28)
NetM2_5: Bluetooth (M2.5), MCU (U5.32)
NetM3_11: Bluetooth (M3.11), MCU (U5.14)
NetM6_4: MCU (U5.38), RF (M6.4)
NetM6_5: MCU (U5.39), RF (M6.5)
NetM6_6: MCU (U5.41), RF (M6.6)
NetM6_7: MCU (U5.40), RF (M6.7)
NetM6_8: MCU (U5.33), RF (M6.8)
NetR26_1: MCU (U5.15), Power (R26.1)
NetU4_2: MCU (U5.10), Motor (U4.2)
NetU4_3: MCU (U5.3), Motor (U4.3)
NetU4_4: MCU (U5.11), Motor (U4.4)
NetU4_5: MCU (U5.5), Motor (U4.5)
NetU4_6: MCU (U5.4), Motor (U4.6)
NetU4_7: MCU (U5.6), Motor (U4.7)
RF_RXD: MCU (U5.21), RF (M7.2 M8.2 M9.3 P28.5)
RF_SET: MCU (U5.19), RF (M7.4 P28.3)
RF_TXD: MCU (U5.22), RF (M7.3 M8.3 M9.4 P28.4)